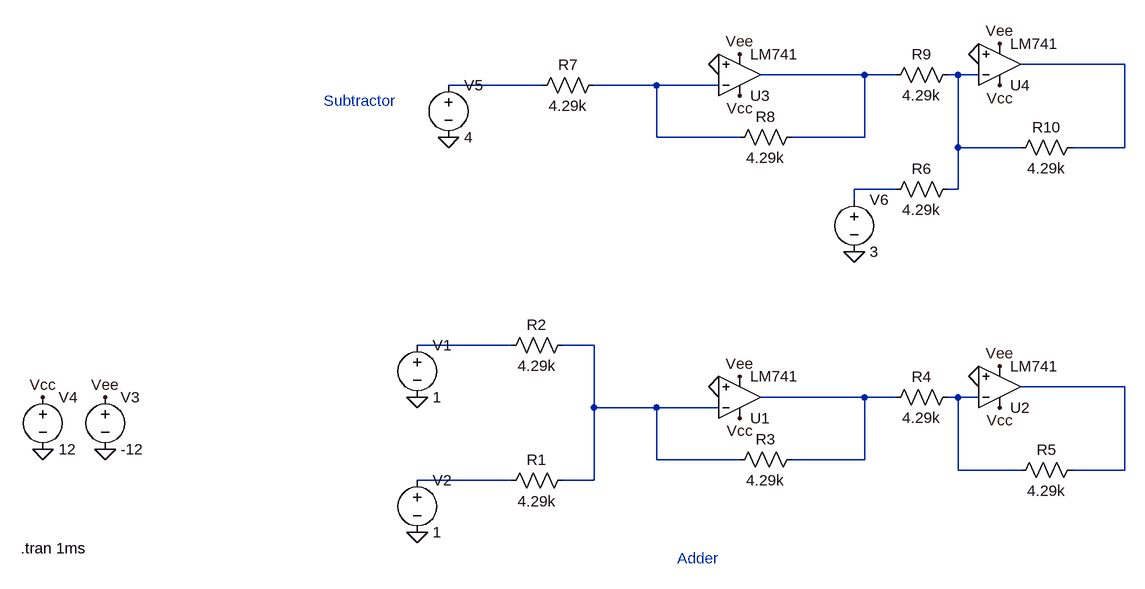
[diagram p0: schematic Adder-Subtractor.asc]
Adder-Subtractor.asc, the LTspice schematic file:
Version 4
SHEET 1 1124 680
WIRE 1120 -400 960 -400
WIRE 720 -384 560 -384
WIRE 768 -384 720 -384
WIRE 864 -384 848 -384
WIRE 896 -384 864 -384
WIRE 224 -368 80 -368
WIRE 400 -368 304 -368
WIRE 496 -368 400 -368
WIRE 400 -288 400 -368
WIRE 528 -288 400 -288
WIRE 720 -288 720 -384
WIRE 720 -288 608 -288
WIRE 864 -272 864 -384
WIRE 960 -272 864 -272
WIRE 1120 -272 1120 -400
WIRE 1120 -272 1040 -272
WIRE 768 -208 704 -208
WIRE 864 -208 864 -272
WIRE 864 -208 848 -208
WIRE 704 -192 704 -208
WIRE 176 32 32 32
WIRE 304 32 256 32
WIRE 1120 96 960 96
WIRE 720 112 560 112
WIRE 768 112 720 112
WIRE 864 112 848 112
WIRE 896 112 864 112
WIRE 304 128 304 32
WIRE 400 128 304 128
WIRE 496 128 400 128
WIRE 400 208 400 128
WIRE 528 208 400 208
WIRE 720 208 720 112
WIRE 720 208 608 208
WIRE 864 224 864 112
WIRE 960 224 864 224
WIRE 1120 224 1120 96
WIRE 1120 224 1040 224
WIRE 176 240 32 240
WIRE 304 240 304 128
WIRE 304 240 256 240
FLAG 32 320 0
FLAG 32 112 0
FLAG 496 96 0
FLAG 896 80 0
FLAG -544 192 0
FLAG -448 192 0
FLAG -544 112 Vcc
FLAG -448 112 Vee
FLAG 528 80 Vee
FLAG 928 64 Vee
FLAG 528 144 Vcc
FLAG 928 128 Vcc
FLAG 80 -288 0
FLAG 496 -400 0
FLAG 896 -416 0
FLAG 528 -416 Vee
FLAG 928 -432 Vee
FLAG 528 -352 Vcc
FLAG 928 -368 Vcc
FLAG 704 -112 0
SYMBOL voltage 32 16 R0
WINDOW 123 0 0 Left 2
WINDOW 39 0 0 Left 2
SYMATTR InstName V1
SYMATTR Value 1
SYMBOL voltage 32 224 R0
WINDOW 123 0 0 Left 2
WINDOW 39 0 0 Left 2
SYMATTR InstName V2
SYMATTR Value 1
SYMBOL res 272 224 R90
WINDOW 0 0 56 VBottom 2
WINDOW 3 32 56 VTop 2
SYMATTR InstName R1
SYMATTR Value 4.29k
SYMBOL res 272 16 R90
WINDOW 0 0 56 VBottom 2
WINDOW 3 32 56 VTop 2
SYMATTR InstName R2
SYMATTR Value 4.29k
SYMBOL LM741 528 176 M180
SYMATTR InstName U1
SYMBOL res 624 192 R90
WINDOW 0 0 56 VBottom 2
WINDOW 3 32 56 VTop 2
SYMATTR InstName R3
SYMATTR Value 4.29k
SYMBOL res 864 96 R90
WINDOW 0 0 56 VBottom 2
WINDOW 3 32 56 VTop 2
SYMATTR InstName R4
SYMATTR Value 4.29k
SYMBOL LM741 928 160 M180
SYMATTR InstName U2
SYMBOL res 1056 208 R90
WINDOW 0 0 56 VBottom 2
WINDOW 3 32 56 VTop 2
SYMATTR InstName R5
SYMATTR Value 4.29k
SYMBOL voltage -448 96 R0
WINDOW 123 0 0 Left 2
WINDOW 39 0 0 Left 2
SYMATTR InstName V3
SYMATTR Value -12
SYMBOL voltage -544 96 R0
WINDOW 123 0 0 Left 2
WINDOW 39 0 0 Left 2
SYMATTR InstName V4
SYMATTR Value 12
SYMBOL voltage 80 -384 R0
WINDOW 123 0 0 Left 2
WINDOW 39 0 0 Left 2
SYMATTR InstName V5
SYMATTR Value 4
SYMBOL res 320 -384 R90
WINDOW 0 0 56 VBottom 2
WINDOW 3 32 56 VTop 2
SYMATTR InstName R7
SYMATTR Value 4.29k
SYMBOL LM741 528 -320 M180
SYMATTR InstName U3
SYMBOL res 624 -304 R90
WINDOW 0 0 56 VBottom 2
WINDOW 3 32 56 VTop 2
SYMATTR InstName R8
SYMATTR Value 4.29k
SYMBOL res 864 -400 R90
WINDOW 0 0 56 VBottom 2
WINDOW 3 32 56 VTop 2
SYMATTR InstName R9
SYMATTR Value 4.29k
SYMBOL LM741 928 -336 M180
SYMATTR InstName U4
SYMBOL res 1056 -288 R90
WINDOW 0 0 56 VBottom 2
WINDOW 3 32 56 VTop 2
SYMATTR InstName R10
SYMATTR Value 4.29k
SYMBOL voltage 704 -208 R0
WINDOW 123 0 0 Left 2
WINDOW 39 0 0 Left 2
SYMATTR InstName V6
SYMATTR Value 3
SYMBOL res 864 -224 R90
WINDOW 0 0 56 VBottom 2
WINDOW 3 32 56 VTop 2
SYMATTR InstName R6
SYMATTR Value 4.29k
TEXT -578 344 Left 2 !.tran 1ms
TEXT 432 360 Left 2 ;Adder
TEXT -112 -344 Left 2 ;Subtractor

The netlist it stands for:
* Adder-Subtractor.asc
V1 N007 0 1
V2 N012 0 1
R1 N008 N012 4.29k
R2 N008 N007 4.29k
XU1 0 N008 Vcc Vee N010 LM741  ; pins In+ In- V+ V- OUT
R3 N010 N008 4.29k
R4 N011 N010 4.29k
XU2 0 N011 Vcc Vee N009 LM741  ; pins In+ In- V+ V- OUT
R5 N009 N011 4.29k
V3 Vee 0 -12
V4 Vcc 0 12
V5 N004 0 4
R7 N005 N004 4.29k
XU3 0 N005 Vcc Vee N002 LM741  ; pins In+ In- V+ V- OUT
R8 N002 N005 4.29k
R9 N003 N002 4.29k
XU4 0 N003 Vcc Vee N001 LM741  ; pins In+ In- V+ V- OUT
R10 N001 N003 4.29k
V6 N006 0 3
R6 N003 N006 4.29k
.tran 1ms
* Adder
* Subtractor
.lib LM741.lib
.backanno
.end